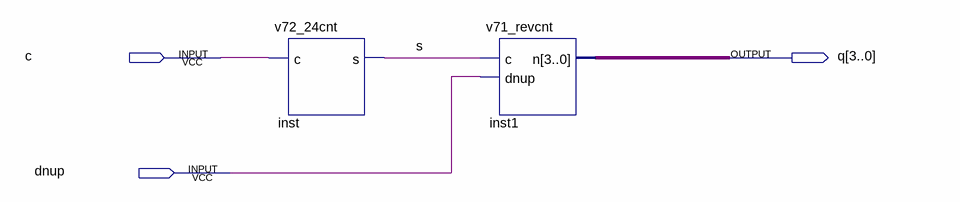
[diagram p0: schematic sheet]
// Quartus schematic sv72.bdf as structural Verilog: 2 symbols, 3 pins
module sv72 (
  input  c,
  input  dnup,
  output [3:0] q
);

  wire s;

  v72_24cnt inst (.c(c), .s(s));
  v71_revcnt inst1 (.c(s), .dnup(dnup), .n(q));
endmodule
